# EAGLE design ranging_board_v3 (EAGLE 9.0.0)
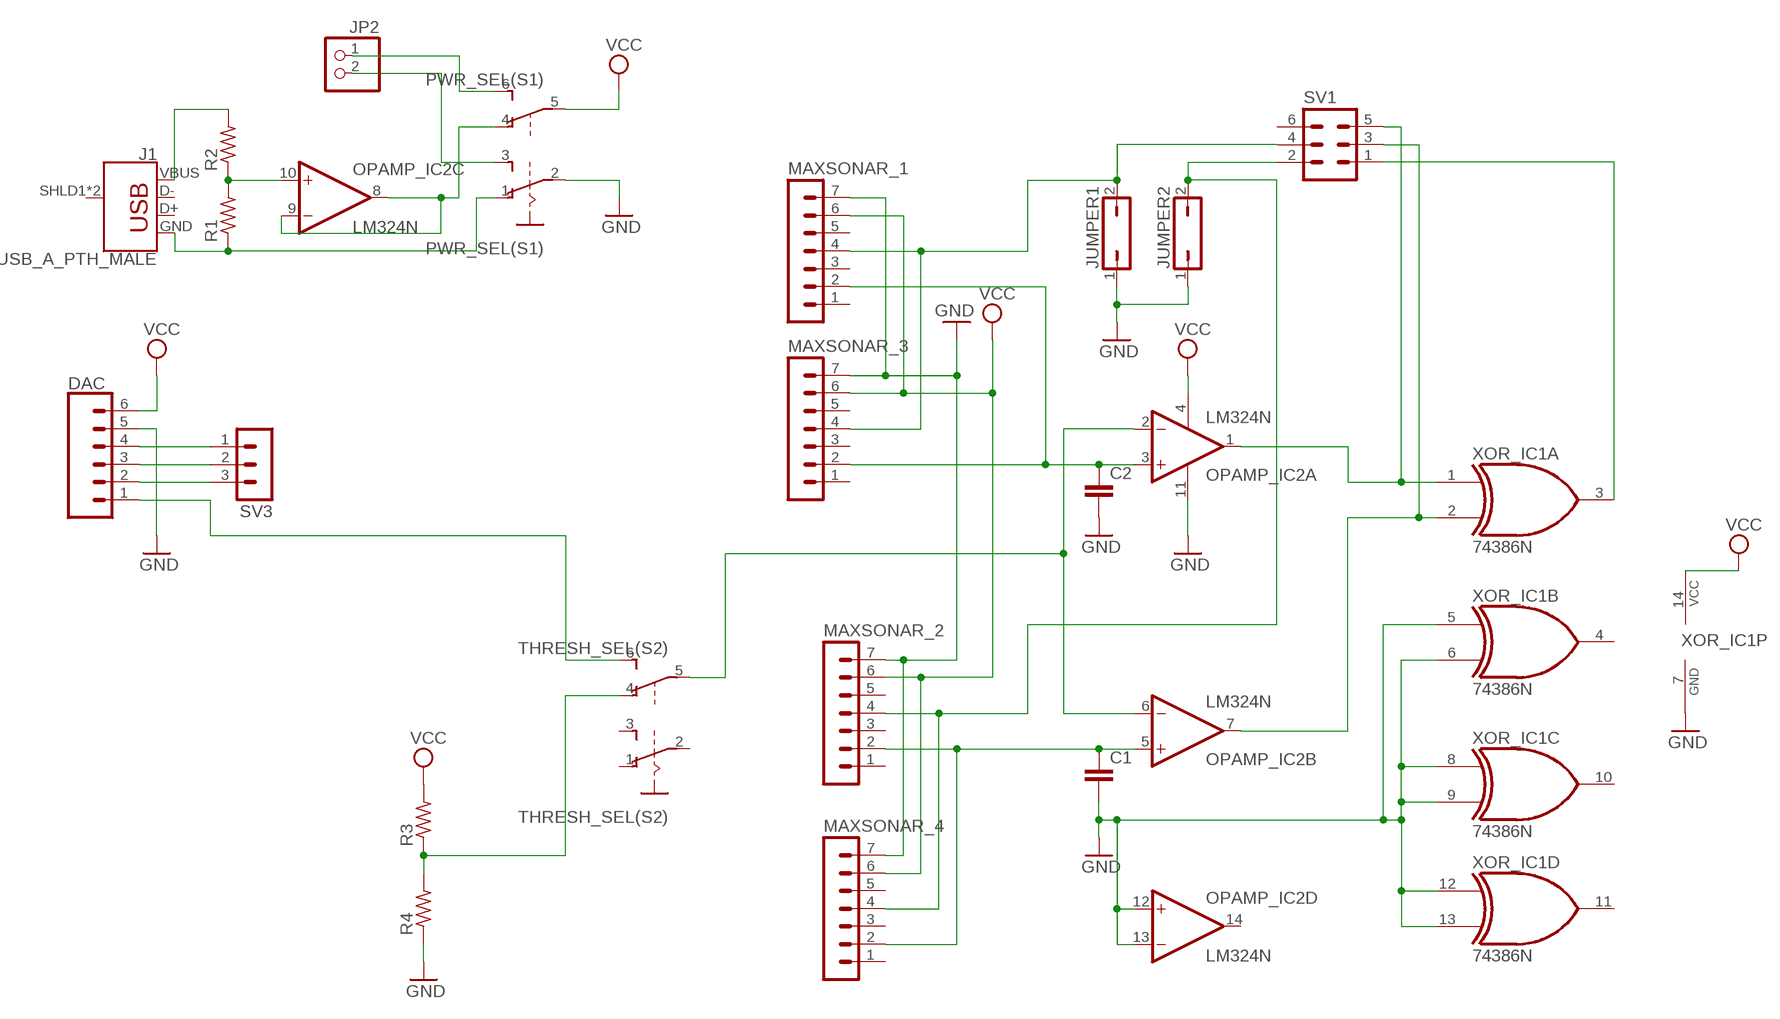
[diagram p0: schematic, sheet 1]

## Parts
C1  C5/3  [C5B3]
C2  C5/3  [C5B3]
DAC  CONN_06SILK_FEMALE_PTH  [1X06]
J1  USB_A_PTH_MALE  [USB-A-H]
JP2  PINHD-1X2  [1X02]
JUMPER1  JP1Q  [JP1]
JUMPER2  JP1Q  [JP1]
MAXSONAR_1  MA07-1  [MA07-1]
MAXSONAR_2  MA07-1  [MA07-1]
MAXSONAR_3  MA07-1  [MA07-1]
MAXSONAR_4  MA07-1  [MA07-1]
OPAMP_IC2  LM324N  [DIL14]
PWR_SEL(S1)  A68-A31  [A68-A31]
R1  R-US_0204/7  [0204/7]
R2  R-US_0204/7  [0204/7]
R3  R-US_0204/7  [0204/7]
R4  R-US_0204/7  [0204/7]
SV1  MA03-2  [MA03-2]
SV3  MA03-1  [MA03-1]
THRESH_SEL(S2)  A68-A31  [A68-A31]
XOR_IC1  74386N  [DIL14]

## Nets
GND: C1.2 C2.2 DAC.5 JUMPER1.1 JUMPER2.1 MAXSONAR_1.7 MAXSONAR_2.7 MAXSONAR_3.7 MAXSONAR_4.7 OPAMP_IC2.11(P:V-) OPAMP_IC2.12(D:+IN) OPAMP_IC2.13(D:-IN) PWR_SEL(S1).2(A:P) R4.1 XOR_IC1.5(B:I0) XOR_IC1.6(B:I1) XOR_IC1.7(P:GND) XOR_IC1.8(C:I0) XOR_IC1.9(C:I1) XOR_IC1.12(D:I0) XOR_IC1.13(D:I1)
N$1: R3.1 R4.2 THRESH_SEL(S2).4(B:O)
N$3: DAC.4 SV3.1
N$4: DAC.2 SV3.3
N$5: DAC.3 SV3.2
N$6: DAC.1 THRESH_SEL(S2).6(B:S)
N$7: OPAMP_IC2.10(C:+IN) R1.2 R2.1
N$8: J1.VBUS R2.2
N$10: OPAMP_IC2.8(C:OUT) OPAMP_IC2.9(C:-IN) PWR_SEL(S1).4(B:O)
N$13: J1.GND PWR_SEL(S1).1(A:O) R1.1
N$14: JP2.2 PWR_SEL(S1).3(A:S)
N$15: JP2.1 PWR_SEL(S1).6(B:S)
RX_1: C2.1 MAXSONAR_1.2 MAXSONAR_3.2 OPAMP_IC2.3(A:+IN)
RX_2: C1.1 MAXSONAR_2.2 MAXSONAR_4.2 OPAMP_IC2.5(B:+IN)
RX_PIN1: OPAMP_IC2.1(A:OUT) SV1.5 XOR_IC1.1(A:I0)
RX_PIN2: OPAMP_IC2.7(B:OUT) SV1.3 XOR_IC1.2(A:I1)
THRESH: OPAMP_IC2.2(A:-IN) OPAMP_IC2.6(B:-IN) THRESH_SEL(S2).5(B:P)
TX_1: JUMPER1.2 MAXSONAR_1.4 MAXSONAR_3.4 SV1.4
TX_2: JUMPER2.2 MAXSONAR_2.4 MAXSONAR_4.4 SV1.2
VCC: DAC.6 MAXSONAR_1.6 MAXSONAR_2.6 MAXSONAR_3.6 MAXSONAR_4.6 OPAMP_IC2.4(P:V+) PWR_SEL(S1).5(B:P) R3.2 XOR_IC1.14(P:VCC)
XOR_PIN: SV1.1 XOR_IC1.3(A:O)
Unconnected: J1.D+ J1.D- J1.SHLD1(SHIELD) J1.SHLD2(SHIELD) MAXSONAR_1.1 MAXSONAR_1.3 MAXSONAR_1.5 MAXSONAR_2.1 MAXSONAR_2.3 MAXSONAR_2.5 MAXSONAR_3.1 MAXSONAR_3.3 MAXSONAR_3.5 MAXSONAR_4.1 MAXSONAR_4.3 MAXSONAR_4.5 OPAMP_IC2.14(D:OUT) SV1.6 THRESH_SEL(S2).1(A:O) THRESH_SEL(S2).2(A:P) THRESH_SEL(S2).3(A:S) XOR_IC1.4(B:O) XOR_IC1.10(C:O) XOR_IC1.11(D:O)

## Library data of the parts
C1 C2 = capacitor-wima:C: CAPACITOR naming: grid - package width
DAC = SparkFun-Connectors:CONN_06: Multi connection point. Often used as Generic Header-pin footprint for 0.1 inch spaced/style header connections On any of the 0.1 inch spaced packages, you can populate with these: Break Away Headers - Straight <https://www.sparkfun.com/products/116> (PRT-00116) Break Away Male Headers - Right Angle <https://www.sparkfun.com/products/553> (PRT-00553) Female Headers <https://www.sparkfun.com/products/115> (PRT-00115) Break Away Headers - Machine Pin <https://www.sparkfun.com/products/117> (PRT-00117) Break Away Female Headers - Swiss Machine Pin <https://www.sparkfun.com/products/743> (PRT-00743) Arduino Stackable Header - 6 Pin <https://www.sparkfun.com/products/9280> (PRT-09280) For SCREWTERMINALS and SPRING TERMINALS visit here: Screw Terimnals on SparkFun.com <https://www.sparkfun.com/search/results?term=Screw+Terminals> (5mm/3.5mm/2.54mm spacing) This device is also useful as a general connection point to wire up your design to another part of your project. Our various solder wires solder well into these plated through hole pads. Hook-Up Wire - Assortment (Stranded, 22 AWG) <https://www.sparkfun.com/products/11375> (PRT-11375) Hook-Up Wire - Assortment (Solid Core, 22 AWG) <https://www.sparkfun.com/products/11367> (PRT-11367) View the entire wire category on our website here <https://www.sparkfun.com/categories/141>; PROD_ID: CONN-08437
J1 = SparkFun-Connectors:USB_A: USB-A Connector Male and female variants, as well as PTH and SMT variants SparkFun Products: SparkFun XBee Explorer Dongle <https://www.sparkfun.com/products/11697> PTH Male SparkFun MicroView-USB Programmer <https://www.sparkfun.com/products/12924> SMT Male SparkFun USB Type A Female Breakout <https://www.sparkfun.com/products/12700> SMT Female; PROD_ID: CONN-08367; SF_ID: PRT-00437
JP2 = pinhead:PINHD-1X2: PIN HEADER
JUMPER1 JUMPER2 = jumper:JP1Q: JUMPER
MAXSONAR_1-MAXSONAR_4 = con-lstb:MA07-1: PIN HEADER; OC_FARNELL: unknown; OC_NEWARK: unknown
OPAMP_IC2 = linear:LM324: OP AMP
PWR_SEL(S1) THRESH_SEL(S2) = switch:A68-A31: SLIDING SWITCH Siemens, distributor Buerklin, 11G766
R1-R4 = resistor:R-US_: RESISTOR, American symbol
SV1 = con-lstb:MA03-2: PIN HEADER; OC_FARNELL: unknown; OC_NEWARK: unknown
SV3 = con-lstb:MA03-1: PIN HEADER; OC_FARNELL: unknown; OC_NEWARK: unknown
XOR_IC1 = 74xx-us:74*386: Quadruple 2-input EXCLUSIVE-OR (XOR) gate

## Board
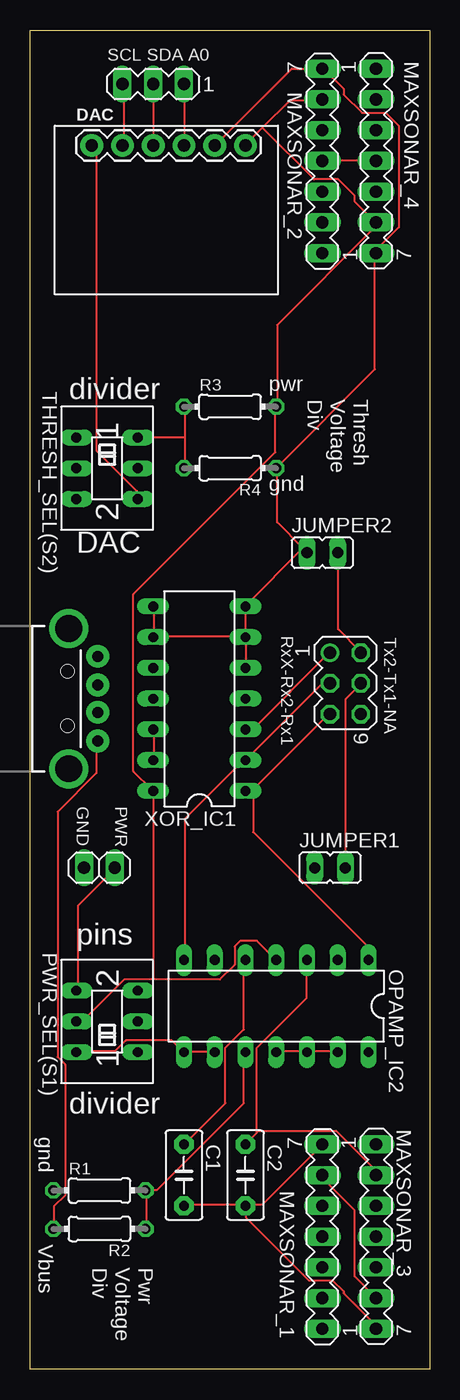
[diagram p1: board, top side]
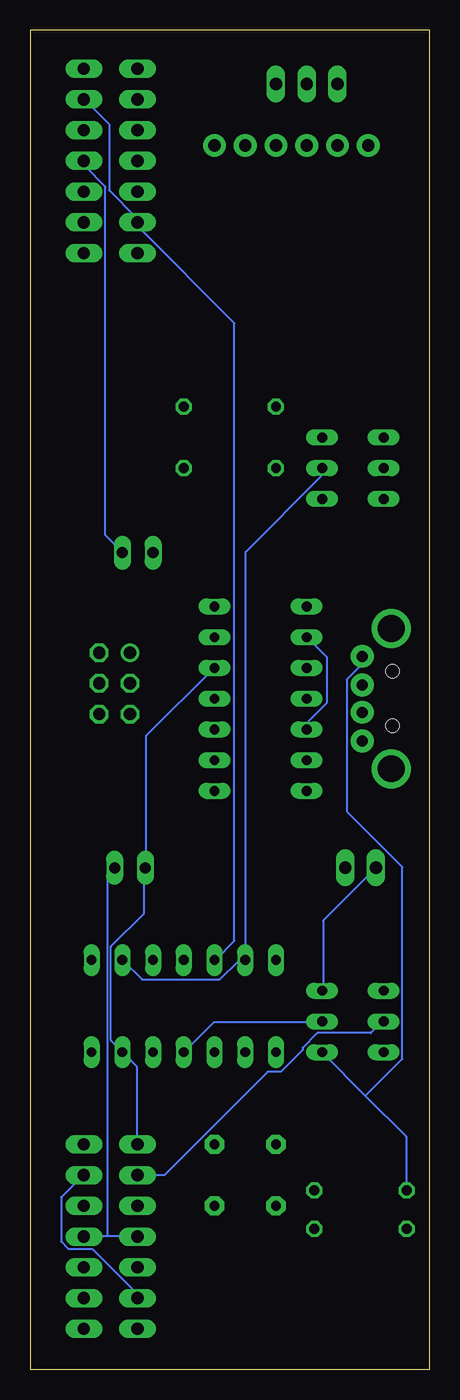
[diagram p2: board, bottom side, seen from below]

Size 33 x 110.66 mm. Coordinates in mm from the lower left corner, seen from the top.
Outline: 0,110.66 33,110.66 33,0 0,0 0,110.66
Copper layers (1*16): Top 0.035mm / dielectric 1.5mm / Bottom 0.035mm
Design rules "default": minimum track width 6mil, minimum drill 0.35mm, track to track 6mil, track to pad 6mil, pad to pad 6mil, via to via 6mil, smd to smd 6mil, copper to edge 40mil, drill to drill 6mil, minimum pad ring 10mil, minimum via ring 8mil, stop-mask expansion 4mil, vias tented up to drill 0mil, thermal gap 10mil

### Footprints (pad centres in the part's own frame; a part is rotated, then mirrored left to right if it is on the bottom)
C5B3 = drill 0.813 pad 1.6 octagon: 1 -2.54,0; 2 2.54,0
1X06 = drill 1.016 pad 1.88: 1 0,0; 2 2.54,0; 3 5.08,0; 4 7.62,0; 5 10.16,0; 6 12.7,0
USB-A-H = drill 0.914 pad 1.88: D+ 2.4,1.127; D- 2.4,-1.127; GND 2.4,3.5; VBUS 2.4,-3.5 | drill 2.2: SHLD1 0,-5.8; SHLD2 0,5.8 | hole 1.1: -0.1,2.25; -0.1,-2.25
1X02 = drill 1.016 long: 1 -1.27,0; 2 1.27,0
JP1 = drill 0.914 long: 1 0,-1.27; 2 0,1.27
MA07-1 = drill 1.016 long: 1 -7.62,0; 2 -5.08,0; 3 -2.54,0; 4 0,0; 5 2.54,0; 6 5.08,0; 7 7.62,0
DIL14 = drill 0.813 long: 1 -7.62,-3.81; 2 -5.08,-3.81; 3 -2.54,-3.81; 4 0,-3.81; 5 2.54,-3.81; 6 5.08,-3.81; 7 7.62,-3.81; 8 7.62,3.81; 9 5.08,3.81; 10 2.54,3.81; 11 0,3.81; 12 -2.54,3.81; 13 -5.08,3.81; 14 -7.62,3.81
A68-A31 = drill 0.813 long: 1 -2.54,-2.54; 2 0,-2.54; 3 2.54,-2.54; 4 -2.54,2.54; 5 0,2.54; 6 2.54,2.54
0204/7 = drill 0.813 octagon: 1 -3.81,0; 2 3.81,0
MA03-2 = drill 1.016: 1 -2.54,-1.27 | drill 1.016 octagon: 2 -2.54,1.27; 3 0,-1.27; 4 0,1.27; 5 2.54,-1.27; 6 2.54,1.27
MA03-1 = drill 1.016 long: 1 -2.54,0; 2 0,0; 3 2.54,0

### Placement (x,y rotation side)
C1  12.7,16.05 270 top
C2  17.78,16.05 270 top
DAC  5.08,101.14 0 top
J1  3.17,55.41 0 top
JP2  5.71,41.45 180 top
JUMPER1  24.77,41.45 270 top
JUMPER2  24.13,67.48 270 top
MAXSONAR_1  24.13,10.96 90 top
MAXSONAR_2  24.13,99.86 90 top
MAXSONAR_3  28.57,10.96 270 top
MAXSONAR_4  28.57,99.86 270 top
OPAMP_IC2  20.32,30.02 180 top
PWR_SEL(S1)  6.35,28.75 90 top
R1  5.71,14.78 0 top
R2  5.71,11.6 180 top
R3  16.51,79.55 0 top
R4  16.51,74.47 180 top
SV1  26.04,56.69 270 top
SV3  10.16,106.22 180 top
THRESH_SEL(S2)  6.35,74.47 270 top
XOR_IC1  13.97,55.41 90 top

### Tracks (layer width: path | path; a pad name or v marks a point on that pad's centre or on a via)
GND
  Top 0.152: MAXSONAR_3.7 28.47,3.4 28.47,3.7 25.88,6.29 25.88,6.44 24.97,7.36 22.99,7.36 17.8,12.54 17.8,13.45 C2.2 | C1.2 12.78,13.61 17.65,13.61 C2.2 | OPAMP_IC2.13 25.27,26.26 22.99,26.26 OPAMP_IC2.12 22.84,26.26 20.4,26.26 OPAMP_IC2.11 | C2.2 17.8,13.61 19.18,13.61 24.05,18.48 MAXSONAR_1.7 | DAC.5 15.37,101.24 21.61,107.48 MAXSONAR_2.7 24.21,107.48 25.88,105.81 25.88,105.35 27.41,103.83 29.39,103.83 30.45,102.76 30.45,94.38 28.63,92.55 28.63,92.25 MAXSONAR_4.7 28.47,92.25 28.47,82.64 20.4,74.57 R4.1 20.4,74.41 20.4,70 22.53,67.86 | XOR_IC1.13 10.19,50.34 10.19,52.77 XOR_IC1.12 | 10.19,60.55 10.19,62.98 XOR_IC1.8 | XOR_IC1.5 17.8,57.95 17.8,60.39 XOR_IC1.6 | XOR_IC1.6 17.8,60.55 17.8,62.98 XOR_IC1.7 17.8,63.14 22.53,67.86 | 22.53,67.86 22.84,67.56 JUMPER2.1 22.53,67.86 | 10.19,60.55 17.65,60.55 XOR_IC1.6 | 10.19,60.55 XOR_IC1.9
  Bottom 0.152: PWR_SEL(S1).2 8.97,28.69 17.8,28.69 20.24,26.26 OPAMP_IC2.11 | MAXSONAR_1.7 24.21,18.64 24.21,25.04 25.27,26.1 OPAMP_IC2.13 25.43,26.26 26.34,27.17 26.34,34.94 23.6,37.69 23.6,41.34 JUMPER1.1 23.44,41.5 23.44,52.32 17.8,57.95 XOR_IC1.5 | XOR_IC1.12 10.03,52.93 10.03,53.54 8.51,55.06 8.51,58.87 10.03,60.39 XOR_IC1.9
N$1
  Top 0.152: 12.78,77 12.78,79.44 R3.1 | 12.78,77 12.78,74.57 R4.2 | 12.78,77 THRESH_SEL(S2).4
N$3
  Top 0.152: SV3.1 12.78,106.11 12.78,101.24 DAC.4
N$4
  Top 0.152: SV3.3 7.75,106.11 7.75,101.24 DAC.2
N$5
  Top 0.152: SV3.2 10.19,106.11 10.19,101.24 DAC.3
N$6
  Top 0.152: THRESH_SEL(S2).6 8.81,71.98 8.81,72.59 5.46,75.94 5.46,100.78 5.16,101.08 DAC.1
N$7
  Top 0.152: R2.1 9.58,11.62 9.58,14.67 R1.2 9.58,14.83 10.49,14.83 17.65,21.99 17.65,26.1 OPAMP_IC2.10
N$8
  Top 0.152: R2.2 1.96,11.62 1.96,13.45 2.87,14.37 2.87,25.19 2.26,25.8 2.26,46.07 5.46,49.27 5.46,51.86 J1.VBUS
N$10
  Top 0.152: PWR_SEL(S1).4 3.94,26.26 6.99,26.26 7.9,27.17 11.71,27.17 12.62,26.26 OPAMP_IC2.8 12.78,26.26 15.21,26.26 OPAMP_IC2.9
N$13
  Bottom 0.152: 5.31,22.6 8.81,26.1 PWR_SEL(S1).1 | 5.31,22.6 1.96,19.25 1.96,14.83 R1.1 | 5.31,22.6 2.26,25.65 2.26,41.5 6.83,46.07 6.83,57.04 5.61,58.26 5.61,58.87 J1.GND
N$14
  Bottom 0.152: JP2.2 8.81,37.08 8.81,31.29 PWR_SEL(S1).3
N$15
  Top 0.152: PWR_SEL(S1).6 3.94,31.29 3.94,38.3 6.99,41.34 JP2.1
RX_1
  Top 0.152: 18.72,19.7 18.72,19.55 17.8,18.64 C2.1 | 18.72,19.7 18.72,26.56 22.84,30.68 22.84,33.72 OPAMP_IC2.3 | 18.72,19.7 25.27,19.7 28.47,16.5 28.47,16.05 MAXSONAR_3.2
  Bottom 0.152: MAXSONAR_1.2 24.21,5.99 24.21,6.29 27.86,9.95 29.84,9.95 30.45,10.56 30.45,14.22 28.63,16.05 MAXSONAR_3.2
RX_2
  Top 0.152: OPAMP_IC2.5 17.65,33.72 17.65,28.09 16.13,26.56 16.13,21.99 12.78,18.64 C1.1
  Bottom 0.152: MAXSONAR_4.2 28.47,104.89 26.49,102.91 26.49,97.43 24.21,95.14 24.21,94.84 MAXSONAR_2.2 24.05,94.68 24.05,94.38 16.13,86.45 16.13,35.4 17.65,33.88 OPAMP_IC2.5
RX_PIN1
  Top 0.152: 18.41,47.9 17.8,47.9 XOR_IC1.1 18.41,47.9 | 18.41,47.9 24.66,54.15 SV1.5 | 18.41,47.9 18.41,44.39 27.86,34.94 27.86,33.88 OPAMP_IC2.1
RX_PIN2
  Top 0.152: OPAMP_IC2.7 12.78,33.88 12.78,45.46 17.65,50.34 XOR_IC1.2 17.8,50.34 24.05,56.58 24.66,56.58 SV1.3
THRESH
  Bottom 0.152: OPAMP_IC2.2 25.27,33.72 23.75,32.2 17.35,32.2 15.82,33.72 15.37,33.72 OPAMP_IC2.6 15.21,33.88 15.21,67.56 8.97,73.81 8.97,74.41 THRESH_SEL(S2).5
TX_1
  Top 0.152: JUMPER1.2 26.04,55.36 27.25,56.58 SV1.4
  Bottom 0.152: 26.64,11.02 28.47,11.02 MAXSONAR_3.4 | 26.64,11.02 24.21,11.02 MAXSONAR_1.4 | 26.64,11.02 26.64,40.73 26.04,41.34 JUMPER1.2
TX_2
  Top 0.152: MAXSONAR_4.4 MAXSONAR_2.4 | JUMPER2.2 25.43,67.4 25.43,61.16 27.25,59.33 SV1.2
  Bottom 0.152: MAXSONAR_4.4 28.47,99.86 28.47,99.41 26.8,97.73 26.8,68.93 25.43,67.56 JUMPER2.2
VCC
  Top 0.152: 19.18,102.61 17.8,101.24 DAC.6 | 19.18,102.61 21.46,104.89 24.05,104.89 MAXSONAR_2.6 | 19.18,102.61 23.44,98.34 25.43,98.34 26.8,96.97 26.8,96.51 28.47,94.84 MAXSONAR_4.6 28.47,94.68 28.47,94.38 20.4,86.3 20.4,79.6 R3.2 20.24,79.44 20.24,75.79 8.51,64.05 8.51,49.42 10.03,47.9 XOR_IC1.14 10.19,47.74 10.19,32.2 | MAXSONAR_3.6 26.8,7.66 26.8,13.15 24.21,15.74 24.21,16.05 MAXSONAR_1.6 | 10.19,32.2 15.67,32.2 16.89,33.42 16.89,34.94 17.35,35.4 18.72,35.4 20.24,33.88 OPAMP_IC2.4 | 10.19,32.2 7.75,32.2 4.39,28.85 3.94,28.85 PWR_SEL(S1).5
  Bottom 0.152: MAXSONAR_1.6 21.92,16.05 13.39,24.58 12.32,24.58 10.49,26.41 10.49,26.56 9.27,27.78 4.85,27.78 3.94,28.69 PWR_SEL(S1).5
XOR_PIN
  Top 0.152: XOR_IC1.3 17.8,52.93 18.41,52.93 24.66,59.17 SV1.1

### Text on the board
tNames: SCL SDA A0 | pwr | divider | Thresh / Voltage / Div | gnd | DAC | RxX-Rx2-Rx1 | Tx2-Tx1-NA | GND | PWR | pins | divider | gnd | Vbus | Pwr / Voltage / Div